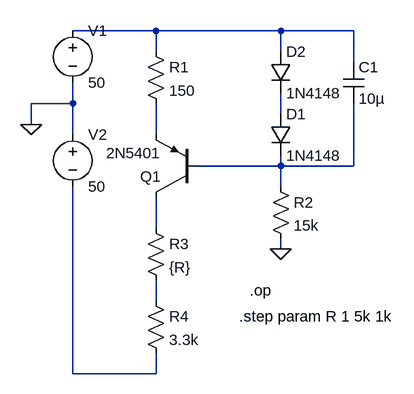
[diagram p0: schematic 2diode.asc]
2diode.asc, the LTspice schematic file:
Version 4
SHEET 1 880 680
WIRE 32 16 -96 16
WIRE 224 16 32 16
WIRE 336 16 224 16
WIRE 32 48 32 16
WIRE 224 48 224 16
WIRE 336 64 336 16
WIRE -96 128 -96 96
WIRE -96 128 -160 128
WIRE 224 144 224 112
WIRE -160 160 -160 128
WIRE -96 176 -96 128
WIRE 32 176 32 128
WIRE 224 224 224 208
WIRE 224 224 96 224
WIRE 336 224 336 128
WIRE 336 224 224 224
WIRE 224 256 224 224
WIRE 32 320 32 272
WIRE 224 352 224 336
WIRE 32 432 32 400
WIRE -96 544 -96 256
WIRE 32 544 32 512
WIRE 32 544 -96 544
FLAG 224 352 0
FLAG -160 160 0
SYMBOL res 16 32 R0
SYMATTR InstName R1
SYMATTR Value 150
SYMBOL diode 208 144 R0
SYMATTR InstName D1
SYMATTR Value 1N4148
SYMBOL diode 208 48 R0
SYMATTR InstName D2
SYMATTR Value 1N4148
SYMBOL res 208 240 R0
SYMATTR InstName R2
SYMATTR Value 15k
SYMBOL cap 320 64 R0
SYMATTR InstName C1
SYMATTR Value 10µ
SYMBOL voltage -96 0 R0
WINDOW 123 0 0 Left 0
WINDOW 39 0 0 Left 0
SYMATTR InstName V1
SYMATTR Value 50
SYMBOL voltage -96 160 R0
WINDOW 123 0 0 Left 0
WINDOW 39 0 0 Left 0
SYMATTR InstName V2
SYMATTR Value 50
SYMBOL pnp 96 272 R180
SYMATTR InstName Q1
SYMATTR Value 2N5401
SYMBOL res 16 304 R0
SYMATTR InstName R3
SYMATTR Value {R}
SYMBOL res 16 416 R0
SYMATTR InstName R4
SYMATTR Value 3.3k
TEXT 160 456 Left 2 !.step param R 1 5k 1k
TEXT 176 416 Left 2 !.op

The netlist it stands for:
* 2diode.asc
R1 N001 N003 150
D1 N002 N004 1N4148
D2 N001 N002 1N4148
R2 N004 0 15k
C1 N001 N004 10µ
V1 N001 0 50
V2 0 N007 50
Q1 N005 N004 N003 0 2N5401
R3 N005 N006 {R}
R4 N006 N007 3.3k
.model D D
.lib standard.dio
.model NPN NPN
.model PNP PNP
.lib standard.bjt
.step param R 1 5k 1k
.op
.backanno
.end

* Results of the author's LTspice run, read from the files saved beside the schematic
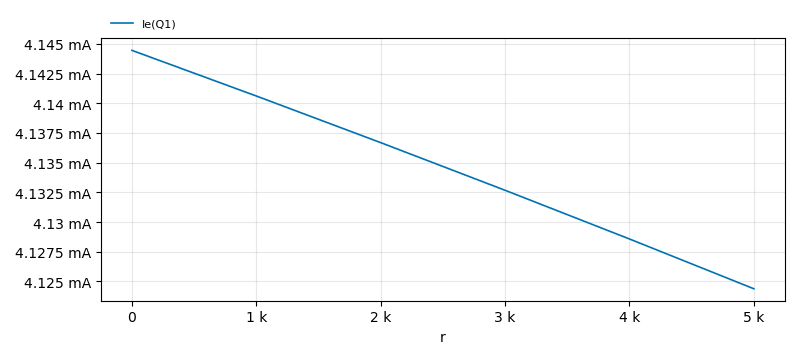
[diagram p1: Operating Point of 2diode.asc, plotted from the saved traces]
* Operating Point, 1 run:
*   Ie(Q1): 4.144 mA at r=1 , 4.124 mA at r=5 k, min 4.124 mA, max 4.144 mA